# Altium schematic sheet Connections.SchDoc
size A4
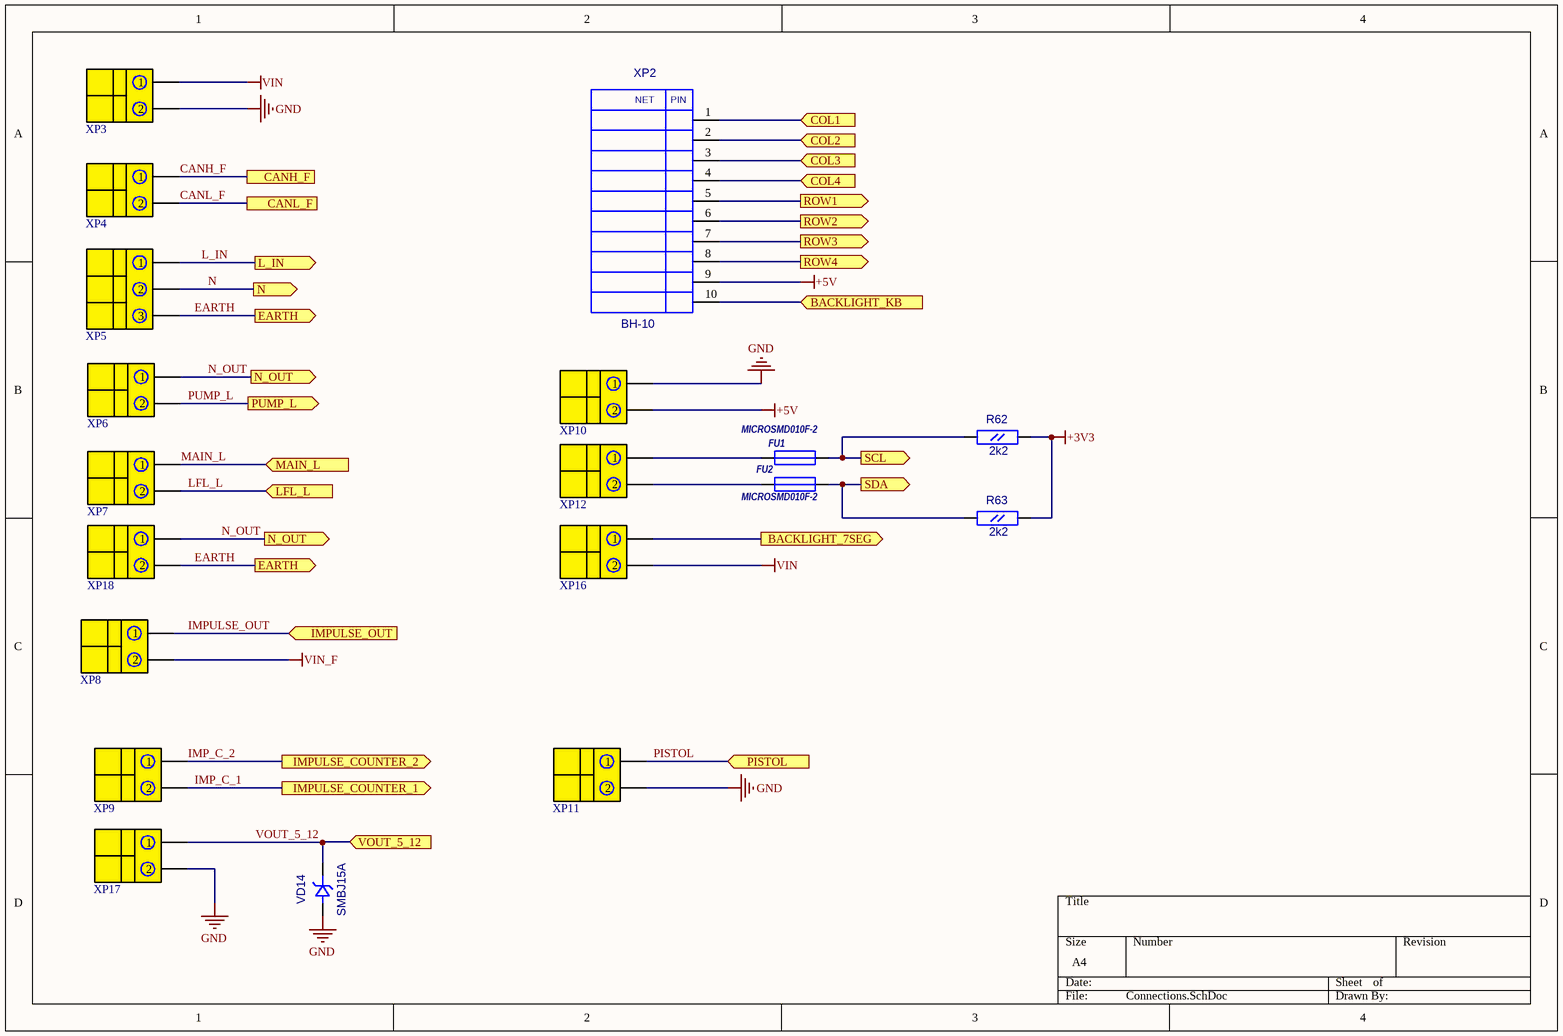
[diagram p0: Connections.SchDoc]

## Parts
FU1  MICROSMD010F-2  [RC1210]
FU2  MICROSMD010F-2  [RC1210]
R62  2k2  [RC0603]
R63  2k2  [RC0603]
VD14  SMBJ15A  [SMB]
XP2  BH-10  [BH-10]
XP3  DG330-2PIN  [DG330-2PIN]  (value not drawn)
XP4  DG330-2PIN  [DG330-2PIN]  (value not drawn)
XP5  DG330-3PIN  [DG330-3PIN]  (value not drawn)
XP6  DG330-2PIN  [DG330-2PIN]  (value not drawn)
XP7  DG330-2PIN  [DG330-2PIN]  (value not drawn)
XP8  DG330-2PIN  [DG330-2PIN]  (value not drawn)
XP9  DG330-2PIN  [DG330-2PIN]  (value not drawn)
XP10  DG330-2PIN  [DG330-2PIN]  (value not drawn)
XP11  DG330-2PIN  [DG330-2PIN]  (value not drawn)
XP12  DG330-2PIN  [DG330-2PIN]  (value not drawn)
XP16  DG330-2PIN  [DG330-2PIN]  (value not drawn)
XP17  DG330-2PIN  [DG330-2PIN]  (value not drawn)
XP18  DG330-2PIN  [DG330-2PIN]  (value not drawn)

## Ports
BACKLIGHT_7SEG (out), BACKLIGHT_KB (in), CANH_F, CANL_F, COL1 (in), COL2 (in), COL3 (in), COL4 (in), EARTH (out), IMPULSE_COUNTER_1 (out), IMPULSE_COUNTER_2 (out), IMPULSE_OUT (in), L_IN (out), LFL_L (in), MAIN_L (in), N (out), N_OUT (out), PISTOL (in), PUMP_L (out), ROW1 (out), ROW2 (out), ROW3 (out), ROW4 (out), SCL (out), SDA (out), VOUT_5_12 (in)

## Nets
+3V3: R62.2(B) R63.2(B)
+5V: XP2.9 XP10.2
GND: VD14.1(A) XP3.2 XP10.1 XP11.2 XP17.2
VIN: XP3.1 XP16.2
VIN_F: XP8.2
BACKLIGHT_7SEG: XP16.1 ; port BACKLIGHT_7SEG
BACKLIGHT_KB: XP2.10 ; port BACKLIGHT_KB
CANH_F: XP4.1 ; port CANH_F
CANL_F: XP4.2 ; port CANL_F
COL1: XP2.1 ; port COL1
COL2: XP2.2 ; port COL2
COL3: XP2.3 ; port COL3
COL4: XP2.4 ; port COL4
EARTH: XP5.3 XP18.2 ; port EARTH
IMP_C_1: XP9.2 ; port IMPULSE_COUNTER_1
IMP_C_2: XP9.1 ; port IMPULSE_COUNTER_2
IMPULSE_OUT: XP8.1 ; port IMPULSE_OUT
L_IN: XP5.1 ; port L_IN
LFL_L: XP7.2 ; port LFL_L
MAIN_L: XP7.1 ; port MAIN_L
N: XP5.2 ; port N
N_OUT: XP6.1 XP18.1 ; port N_OUT
PISTOL: XP11.1 ; port PISTOL
PUMP_L: XP6.2 ; port PUMP_L
ROW1: XP2.5 ; port ROW1
ROW2: XP2.6 ; port ROW2
ROW3: XP2.7 ; port ROW3
ROW4: XP2.8 ; port ROW4
SCL: FU1.2 R62.1(A) ; port SCL
SDA: FU2.2 R63.1(A) ; port SDA
VOUT_5_12: VD14.2(K) XP17.1 ; port VOUT_5_12
NetFU1_1: FU1.1 XP12.1
NetFU2_1: FU2.1 XP12.2

## Notes on the sheet
- (in symbol BH-10) NET; PIN

## Library data of the parts
FU1 FU2 = MICROSMD: Value: MICROSMD010F-2
R62 R63 = RC0603: Value: 2k2
VD14 = SMBJ: Value: SMBJ15A
XP2 = BH-10: Value: *
XP3 XP4 XP6-XP12 XP16-XP18 = DG330-2PIN: Value: DG330-2PIN
XP5 = DG330-3PIN: Value: DG330-3PIN